# Altium schematic sheet Pico.SchDoc
size A4; SheetNumber: 3; SheetTotal: 4
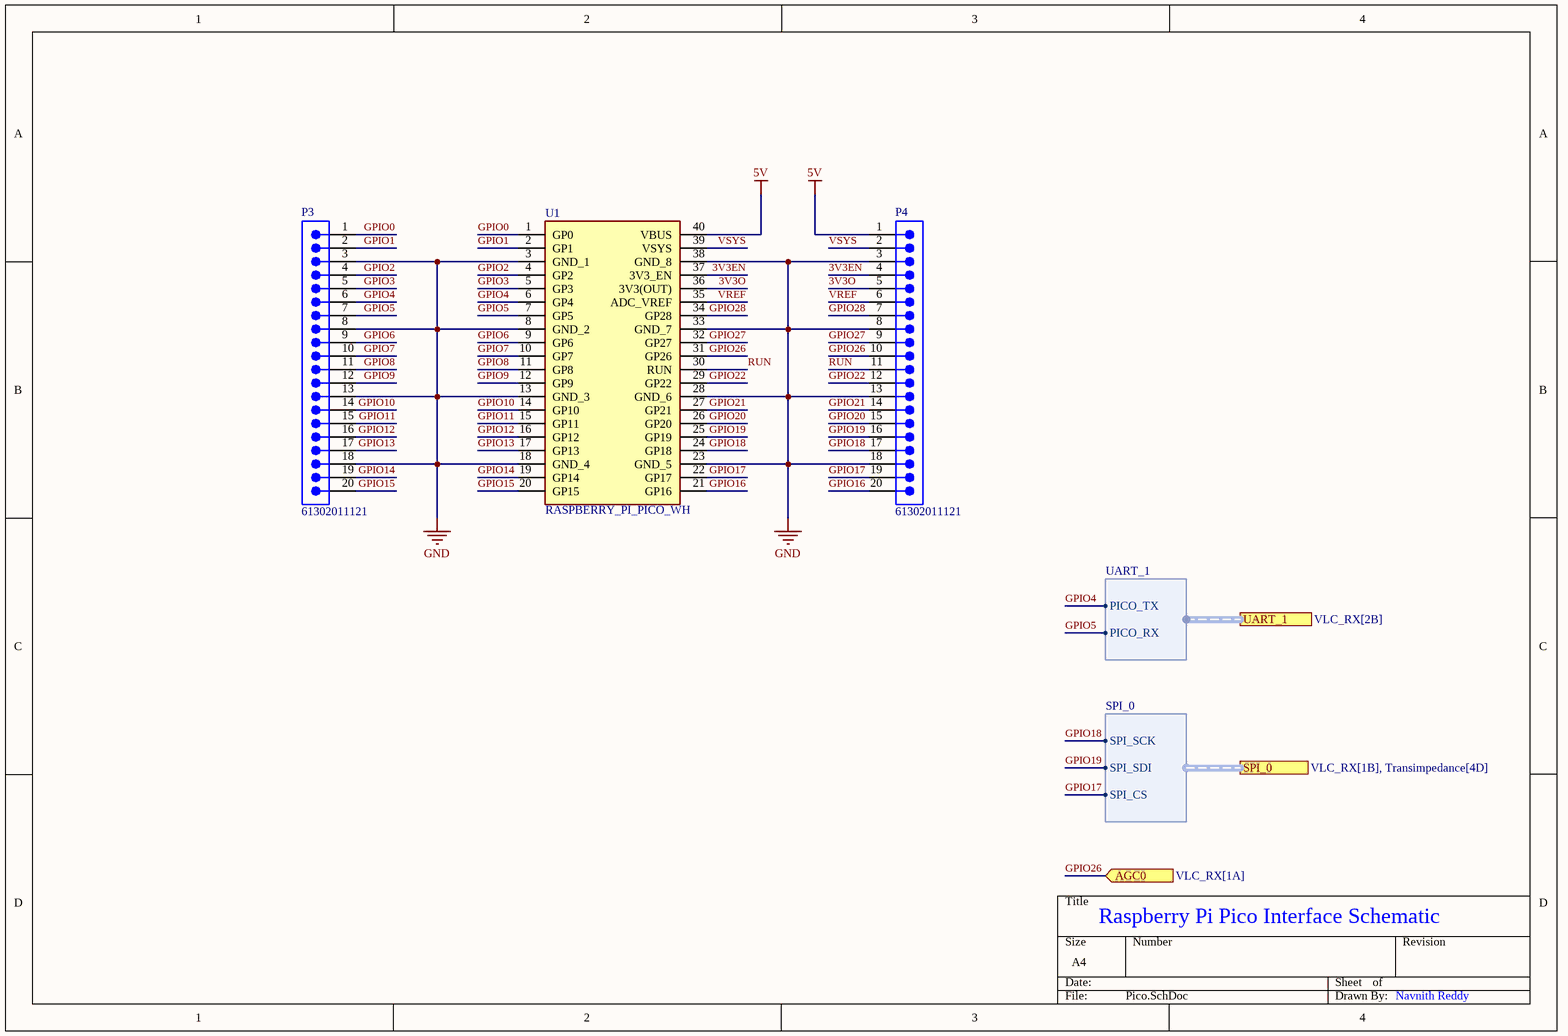
[diagram p0: Pico.SchDoc]

## Parts
P3  61302011121  [61302011121]
P4  61302011121  [61302011121]
U1  RASPBERRY_PI_PICO_WH  [RASPBERRYPIPICOWH]

## Ports
AGC0 (in, see VLC_RX[1A]), SPI_0 (harness SPI_0, see VLC_RX[1B], Transimpedance[4D]), UART_1 (harness UART_1, see VLC_RX[2B])

## Harnesses
SPI_0: SPI_SCK, SPI_SDI, SPI_CS
UART_1: PICO_TX, PICO_RX

## Nets
5V: P4.1 U1.40(VBUS)
GND: P3.3 P3.8 P3.13 P3.18 P4.3 P4.8 P4.13 P4.18 U1.3(GND_1) U1.8(GND_2) U1.13(GND_3) U1.18(GND_4) U1.23(GND_5) U1.28(GND_6) U1.33(GND_7) U1.38(GND_8)
3V3EN: P4.4 U1.37(3V3_EN)
3V3O: P4.5 U1.36(3V3(OUT))
GPIO0: P3.1 U1.1(GP0)
GPIO1: P3.2 U1.2(GP1)
GPIO2: P3.4 U1.4(GP2)
GPIO3: P3.5 U1.5(GP3)
GPIO4: P3.6 U1.6(GP4) ; port UART_1.PICO_TX
GPIO5: P3.7 U1.7(GP5) ; port UART_1.PICO_RX
GPIO6: P3.9 U1.9(GP6)
GPIO7: P3.10 U1.10(GP7)
GPIO8: P3.11 U1.11(GP8)
GPIO9: P3.12 U1.12(GP9)
GPIO10: P3.14 U1.14(GP10)
GPIO11: P3.15 U1.15(GP11)
GPIO12: P3.16 U1.16(GP12)
GPIO13: P3.17 U1.17(GP13)
GPIO14: P3.19 U1.19(GP14)
GPIO15: P3.20 U1.20(GP15)
GPIO16: P4.20 U1.21(GP16)
GPIO17: P4.19 U1.22(GP17) ; port SPI_0.SPI_CS
GPIO18: P4.17 U1.24(GP18) ; port SPI_0.SPI_SCK
GPIO19: P4.16 U1.25(GP19) ; port SPI_0.SPI_SDI
GPIO20: P4.15 U1.26(GP20)
GPIO21: P4.14 U1.27(GP21)
GPIO22: P4.12 U1.29(GP22)
GPIO26: P4.10 U1.31(GP26) ; port AGC0
GPIO27: P4.9 U1.32(GP27)
GPIO28: P4.7 U1.34(GP28)
RUN: P4.11 U1.30(RUN)
VREF: P4.6 U1.35(ADC_VREF)
VSYS: P4.2 U1.39(VSYS)

## Notes on the sheet
- Raspberry Pi Pico Interface Schematic
- Navnith Reddy

## Library data of the parts
P3 P4 = CMP-1502-01102-2: NexarPartId: 32855554; Number of Contacts: 20; Contact Resistance: 20mΩ; Pitch: 2.54mm; Gender: Male; Operating Supply Voltage: 250V; Connector Type: Male Pin; Current Rating: 3A; Packaging: Bulk; RoHS: Compliant; Contact Material: Copper; Contact Mating Length: 5.9944mm; Number of Positions: 20; Orientation: Vertical; Termination: Solder; Number of Pins: 20; Color: Black; REACH SVHC: Unknown; Mount: Through Hole; Contact Plating: Gold; Number of Rows: 1; Lead Pitch: 2.54mm
U1 = RASPBERRY_PI_PICO_WH: Undefined or Miscellaneous; Manufacturer_Name: RASPBERRY-PI; Manufacturer_Part_Number: RASPBERRY PI PICO WH; Datasheet Link: https://datasheets.raspberrypi.com/picow/pico-w-datasheet.pdf; Height: 4mm